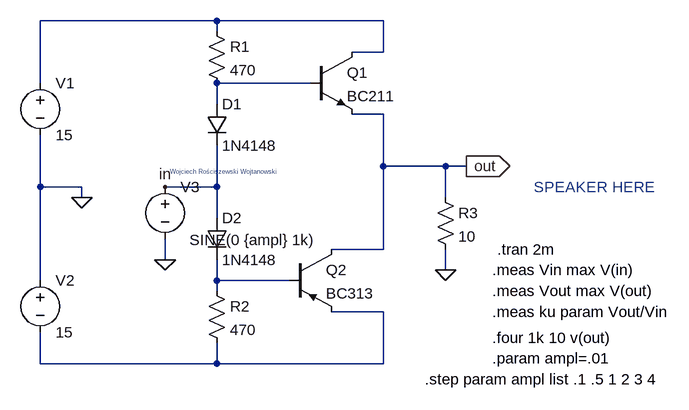
[diagram p0: schematic transistor amplifier circuit 2.asc]
transistor amplifier circuit 2.asc, the LTspice schematic file:
Version 4
SHEET 1 1132 680
WIRE 320 -80 48 -80
WIRE 576 -80 320 -80
WIRE 320 -64 320 -80
WIRE 576 -32 576 -80
WIRE 576 -32 528 -32
WIRE 48 16 48 -80
WIRE 464 16 320 16
WIRE 320 48 320 16
WIRE 576 64 528 64
WIRE 576 144 576 64
WIRE 672 144 576 144
WIRE 704 144 672 144
WIRE 48 176 48 96
WIRE 112 176 48 176
WIRE 320 176 320 112
WIRE 320 176 240 176
WIRE 112 192 112 176
WIRE 672 192 672 144
WIRE 320 224 320 176
WIRE 576 272 576 144
WIRE 576 272 496 272
WIRE 240 288 240 256
WIRE 672 304 672 272
WIRE 48 320 48 176
WIRE 320 320 320 288
WIRE 432 320 320 320
WIRE 320 336 320 320
WIRE 576 368 496 368
WIRE 48 448 48 400
WIRE 320 448 320 416
WIRE 320 448 48 448
WIRE 576 448 576 368
WIRE 576 448 320 448
FLAG 112 192 0
FLAG 240 288 0
FLAG 672 304 0
FLAG 704 144 out
IOPIN 704 144 Out
FLAG 240 176 in
SYMBOL voltage 48 0 R0
WINDOW 123 0 0 Left 0
WINDOW 39 0 0 Left 0
SYMATTR InstName V1
SYMATTR Value 15
SYMBOL voltage 48 304 R0
SYMATTR InstName V2
SYMATTR Value 15
SYMBOL voltage 240 160 R0
WINDOW 3 135 82 Top 2
WINDOW 123 0 0 Left 0
SYMATTR Value SINE(0 {ampl} 1k)
SYMATTR InstName V3
SYMBOL diode 304 48 R0
SYMATTR InstName D1
SYMATTR Value 1N4148
SYMBOL diode 304 224 R0
SYMATTR InstName D2
SYMATTR Value 1N4148
SYMBOL res 304 -80 R0
SYMATTR InstName R1
SYMATTR Value 470
SYMBOL res 304 320 R0
SYMATTR InstName R2
SYMATTR Value 470
SYMBOL npn 464 -32 R0
SYMATTR InstName Q1
SYMATTR Value BC211
SYMBOL pnp 432 272 R0
SYMATTR InstName Q2
SYMATTR Value BC313
SYMBOL res 656 176 R0
SYMATTR InstName R3
SYMATTR Value 10
TEXT 248 152 Left 0 ;Wojciech Rościszewski Wojtanowski
TEXT 744 304 Left 2 !.meas Vin max V(in)
TEXT 744 336 Left 2 !.meas Vout max V(out)
TEXT 744 368 Left 2 !.meas ku param Vout/Vin
TEXT 744 408 Left 2 !.four 1k 10 v(out)
TEXT 744 440 Left 2 !.param ampl=.01
TEXT 640 472 Left 2 !.step param ampl list .1 .5 1 2 3 4
TEXT 808 176 Left 2 ;SPEAKER HERE
TEXT 752 272 Left 2 !.tran 2m

The netlist it stands for:
* transistor amplifier circuit 2.asc
V1 N001 0 15
V2 0 N004 15
V3 in 0 SINE(0 {ampl} 1k)
D1 N002 in 1N4148
D2 in N003 1N4148
R1 N001 N002 470
R2 N003 N004 470
Q1 N001 N002 out 0 BC211
Q2 out N003 N004 0 BC313
R3 out 0 10
.model D D
.lib standard.dio
.model NPN NPN
.model PNP PNP
.lib standard.bjt
* Wojciech Rościszewski Wojtanowski
.meas Vin max V(in)
.meas Vout max V(out)
.meas ku param Vout/Vin
.four 1k 10 v(out)
.param ampl=.01
.step param ampl list .1 .5 1 2 3 4
* SPEAKER HERE
.tran 2m
.backanno
.end